# Altium schematic sheet mainboard.SchDoc
size A3
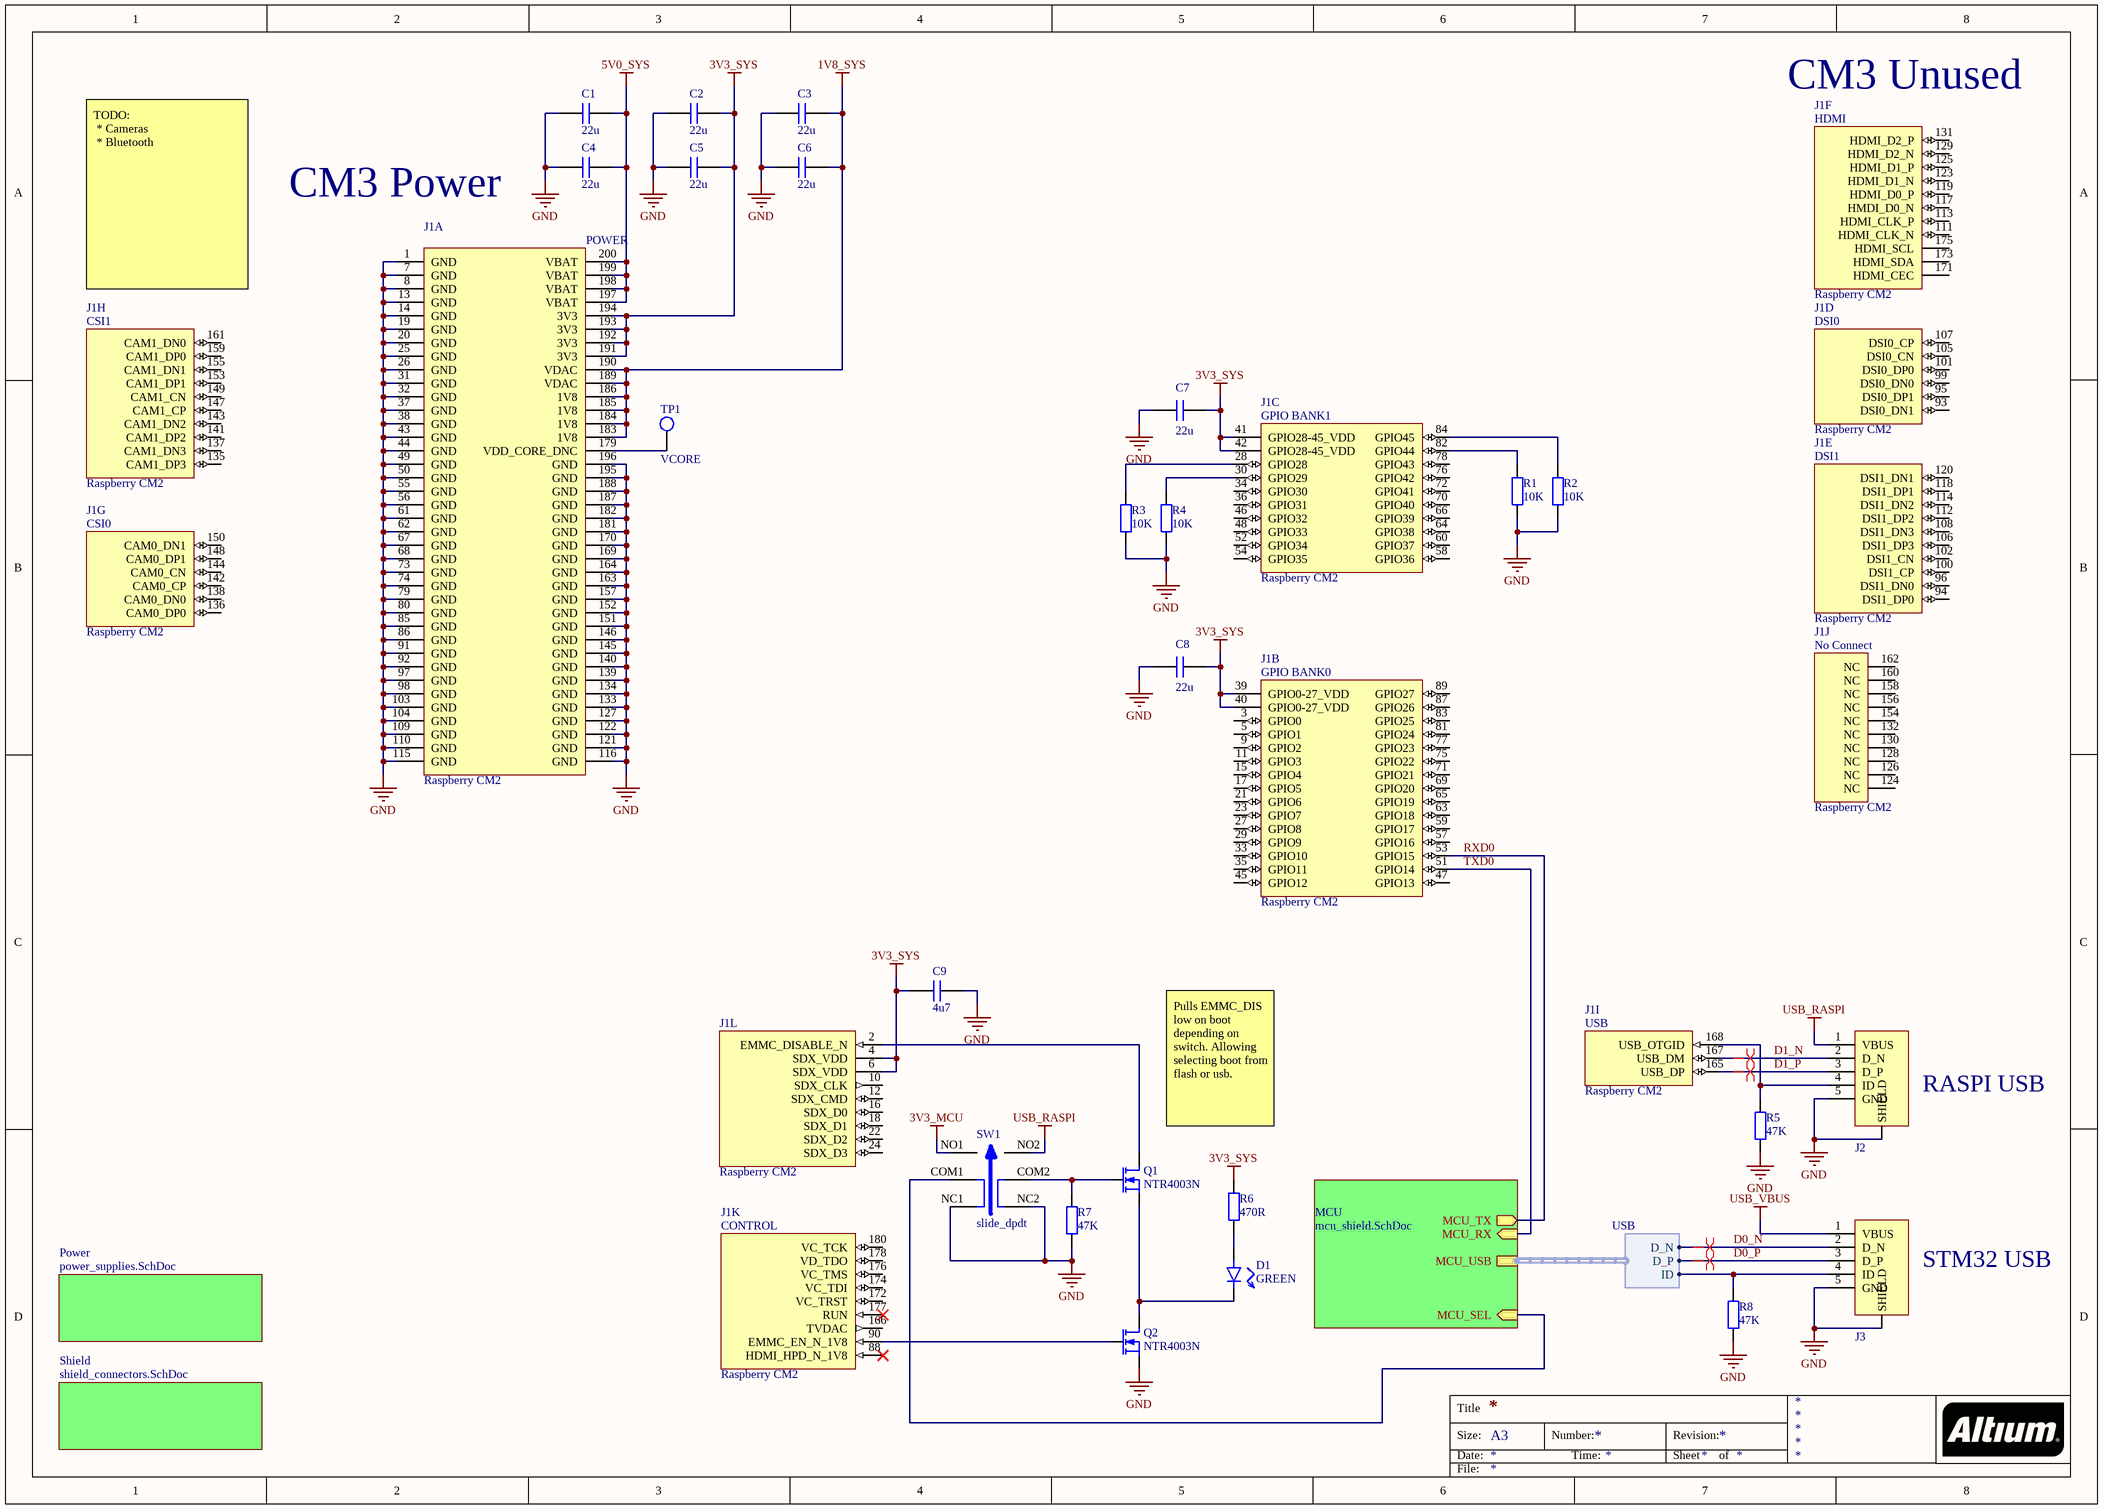
[diagram p0: mainboard.SchDoc]

## Parts
C1  value 22u  [CAPC2012X11N]  (hidden comment: cap)
C2  value 22u  [CAPC2012X11N]  (hidden comment: cap)
C3  value 22u  [CAPC2012X11N]  (hidden comment: cap)
C4  value 22u  [CAPC2012X11N]  (hidden comment: cap)
C5  value 22u  [CAPC2012X11N]  (hidden comment: cap)
C6  value 22u  [CAPC2012X11N]  (hidden comment: cap)
C7  value 22u  [CAPC2012X11N]  (hidden comment: cap)
C8  value 22u  [CAPC2012X11N]  (hidden comment: cap)
C9  value 4u7  [CAPC1608X08N]  (hidden comment: cap)
D1  value GREEN  [CAPCP1005X06N]  (hidden comment: led)
J1  Raspberry CM2  [raspi_cm3]  (parts A,B,C,D,E,F,G,H,I,J,K,L of 12)
J2  usb_micro  [usb_micro_10118192-0001LF]  (value not drawn)
J3  usb_micro  [usb_micro_10118192-0001LF]  (value not drawn)
Q1  NTR4003N  [SOT95P235X100-3N]
Q2  NTR4003N  [SOT95P235X100-3N]
R1  value 10K  [RESC1005X04N]  (hidden comment: res)
R2  value 10K  [RESC1005X04N]  (hidden comment: res)
R3  value 10K  [RESC1005X04N]  (hidden comment: res)
R4  value 10K  [RESC1005X04N]  (hidden comment: res)
R5  value 47K  [RESC1005X04N]  (hidden comment: res)
R6  value 470R  [RESC1005X04N]  (hidden comment: res)
R7  value 47K  [RESC1005X04N]  (hidden comment: res)
R8  value 47K  [RESC1005X04N]  (hidden comment: res)
SW1  slide_dpdt  [JS202011SCQN]
TP1  VCORE  [testpoint_smd]

## Sub-sheets
MCU = mcu_shield.SchDoc: MCU_SEL (in), MCU_USB (harness USB), MCU_TX (out), MCU_RX (in)
Power = power_supplies.SchDoc: no entries
Shield = shield_connectors.SchDoc: no entries

## Harnesses
USB: ID, D_N, D_P

## Nets
1V8_SYS: C3.1 C6.1 J1.183(1V8) J1.184(1V8) J1.185(1V8) J1.186(1V8) J1.189(VDAC) J1.190(VDAC)
3V3_MCU: SW1.NO1
3V3_SYS: C2.1 C5.1 C7.2 C8.2 C9.2 J1.4(SDX_VDD) J1.6(SDX_VDD) J1.39(GPIO0-27_VDD) J1.40(GPIO0-27_VDD) J1.41(GPIO28-45_VDD) J1.42(GPIO28-45_VDD) J1.191(3V3) J1.192(3V3) J1.193(3V3) J1.194(3V3) R6.2
5V0_SYS: C1.1 C4.1 J1.197(VBAT) J1.198(VBAT) J1.199(VBAT) J1.200(VBAT)
GND: C1.2 C2.2 C3.2 C4.2 C5.2 C6.2 C7.1 C8.1 C9.1 J1.1(GND) J1.7(GND) J1.8(GND) J1.13(GND) J1.14(GND) J1.19(GND) J1.20(GND) J1.25(GND) J1.26(GND) J1.31(GND) J1.32(GND) J1.37(GND) J1.38(GND) J1.43(GND) J1.44(GND) J1.49(GND) J1.50(GND) J1.55(GND) J1.56(GND) J1.61(GND) J1.62(GND) J1.67(GND) J1.68(GND) J1.73(GND) J1.74(GND) J1.79(GND) J1.80(GND) J1.85(GND) J1.86(GND) J1.91(GND) J1.92(GND) J1.97(GND) J1.98(GND) J1.103(GND) J1.104(GND) J1.109(GND) J1.110(GND) J1.115(GND) J1.116(GND) J1.121(GND) J1.122(GND) J1.127(GND) J1.133(GND) J1.134(GND) J1.139(GND) J1.140(GND) J1.145(GND) J1.146(GND) J1.151(GND) J1.152(GND) J1.157(GND) J1.163(GND) J1.164(GND) J1.169(GND) J1.170(GND) J1.181(GND) J1.182(GND) J1.187(GND) J1.188(GND) J1.195(GND) J1.196(GND) J2.5(GND) J2.SHIELD J3.5(GND) J3.SHIELD Q2.S R1.1 R2.1 R3.1 R4.1 R5.1 R7.2 R8.1 SW1.NC1 SW1.NC2
USB_RASPI: J2.1(VBUS) SW1.NO2
USB_VBUS: J3.1(VBUS)
D0_N: J3.2(D_N) ; sheet MCU/MCU_USB.D_N
D0_P: J3.3(D_P) ; sheet MCU/MCU_USB.D_P
D1_N: J1.167(USB_DM) J2.2(D_N)
D1_P: J1.165(USB_DP) J2.3(D_P)
RXD0: J1.53(GPIO15) ; sheet MCU/MCU_TX
TXD0: J1.51(GPIO14) ; sheet MCU/MCU_RX
NetD1_A: D1.A R6.1
NetD1_C: D1.C Q1.S Q2.D
NetJ1_2: J1.2(EMMC_DISABLE_N) Q1.D
NetJ1_28: J1.28(GPIO28) R3.2
NetJ1_30: J1.30(GPIO29) R4.2
NetJ1_82: J1.82(GPIO44) R1.2
NetJ1_84: J1.84(GPIO45) R2.2
NetJ1_90: J1.90(EMMC_EN_N_1V8) Q2.G
NetJ1_168: J1.168(USB_OTGID) J2.4(ID) R5.2
NetJ1_179: J1.179(VDD_CORE_DNC) TP1.1
NetJ3_4: J3.4(ID) R8.2 ; sheet MCU/MCU_USB.ID
NetQ1_G: Q1.G R7.1 SW1.COM2
NetSW1_COM1: SW1.COM1 ; sheet MCU/MCU_SEL

Not connected (* = marked no-connect by the designer): J1 3(GPIO0) 5(GPIO1) 9(GPIO2) 10(SDX_CLK) 11(GPIO3) 12(SDX_CMD) 15(GPIO4) 16(SDX_D0) 17(GPIO5) 18(SDX_D1) 21(GPIO6) 22(SDX_D2) 23(GPIO7) 24(SDX_D3) 27(GPIO8) 29(GPIO9) 33(GPIO10) 34(GPIO30) 35(GPIO11) 36(GPIO31) 45(GPIO12) 46(GPIO32) 47(GPIO13) 48(GPIO33) 52(GPIO34) 54(GPIO35) 57(GPIO16) 58(GPIO36) 59(GPIO17) 60(GPIO37) 63(GPIO18) 64(GPIO38) 65(GPIO19) 66(GPIO39) 69(GPIO20) 70(GPIO40) 71(GPIO21) 72(GPIO41) 75(GPIO22) 76(GPIO42) 77(GPIO23) 78(GPIO43) 81(GPIO24) 83(GPIO25) 87(GPIO26) 88(HDMI_HPD_N_1V8)* 89(GPIO27) 93(DSI0_DN1) 94(DSI1_DP0) 95(DSI0_DP1) 96(DSI1_DN0) 99(DSI0_DN0) 100(DSI1_CP) 101(DSI0_DP0) 102(DSI1_CN) 105(DSI0_CN) 106(DSI1_DP3) 107(DSI0_CP) 108(DSI1_DN3) 111(HDMI_CLK_N) 112(DSI1_DP2) 113(HDMI_CLK_P) 114(DSI1_DN2) 117(HMDI_D0_N) 118(DSI1_DP1) 119(HDMI_D0_P) 120(DSI1_DN1) 123(HDMI_D1_N) 124(NC) 125(HDMI_D1_P) 126(NC) 128(NC) 129(HDMI_D2_N) 130(NC) 131(HDMI_D2_P) 132(NC) 135(CAM1_DP3) 136(CAM0_DP0) 137(CAM1_DN3) 138(CAM0_DN0) 141(CAM1_DP2) 142(CAM0_CP) 143(CAM1_DN2) 144(CAM0_CN) 147(CAM1_CP) 148(CAM0_DP1) 149(CAM1_CN) 150(CAM0_DN1) 153(CAM1_DP1) 154(NC) 155(CAM1_DN1) 156(NC) 158(NC) 159(CAM1_DP0) 160(NC) 161(CAM1_DN0) 162(NC) 166(TVDAC) 171(HDMI_CEC) 172(VC_TRST) 173(HDMI_SDA) 174(VC_TDI) 175(HDMI_SCL) 176(VC_TMS) 177(RUN)* 178(VD_TDO) 180(VC_TCK)

## Layout directives
differential pair: D0_N, D0_P, D1_N, D1_P

## Notes on the sheet
- (near J1) CM3 Unused
- CM3 Power
- TODO:
  * Cameras
  * Bluetooth
- Pulls EMMC_DIS low on boot depending on switch. Allowing selecting boot from flash or usb.
- (near J2) RASPI USB
- (near J3) STM32 USB
- Title
- Size:
- Date:
- A3
- Number:
- Time:
- Revision:
- Sheet
- of
- File:
- (in symbol raspicm2, part A) POWER
- (in symbol raspicm2, part B) GPIO BANK0
- (in symbol raspicm2, part C) GPIO BANK1
- (in symbol raspicm2, part D) DSI0
- (in symbol raspicm2, part E) DSI1
- (in symbol raspicm2, part F) HDMI
- (in symbol raspicm2, part G) CSI0
- (in symbol raspicm2, part H) CSI1
- (in symbol raspicm2, part I) USB
- (in symbol raspicm2, part J) No Connect
- (in symbol raspicm2, part K) CONTROL

## Library data of the parts
C1-C9 = cap: Capacitor
D1 = led: pin to pad: A>1 C>2
J1 = raspicm2
J2 J3 = usb_micro: Micro USB Receptacle
Q1 Q2 = ntr4003n: N-channel Mosfet
R1-R8 = res: Resistor
SW1 = slide_dpdt: DPDT
TP1 = testpoint: Test point